# EAGLE schematic řídicí deska (EAGLE 9.5.1)
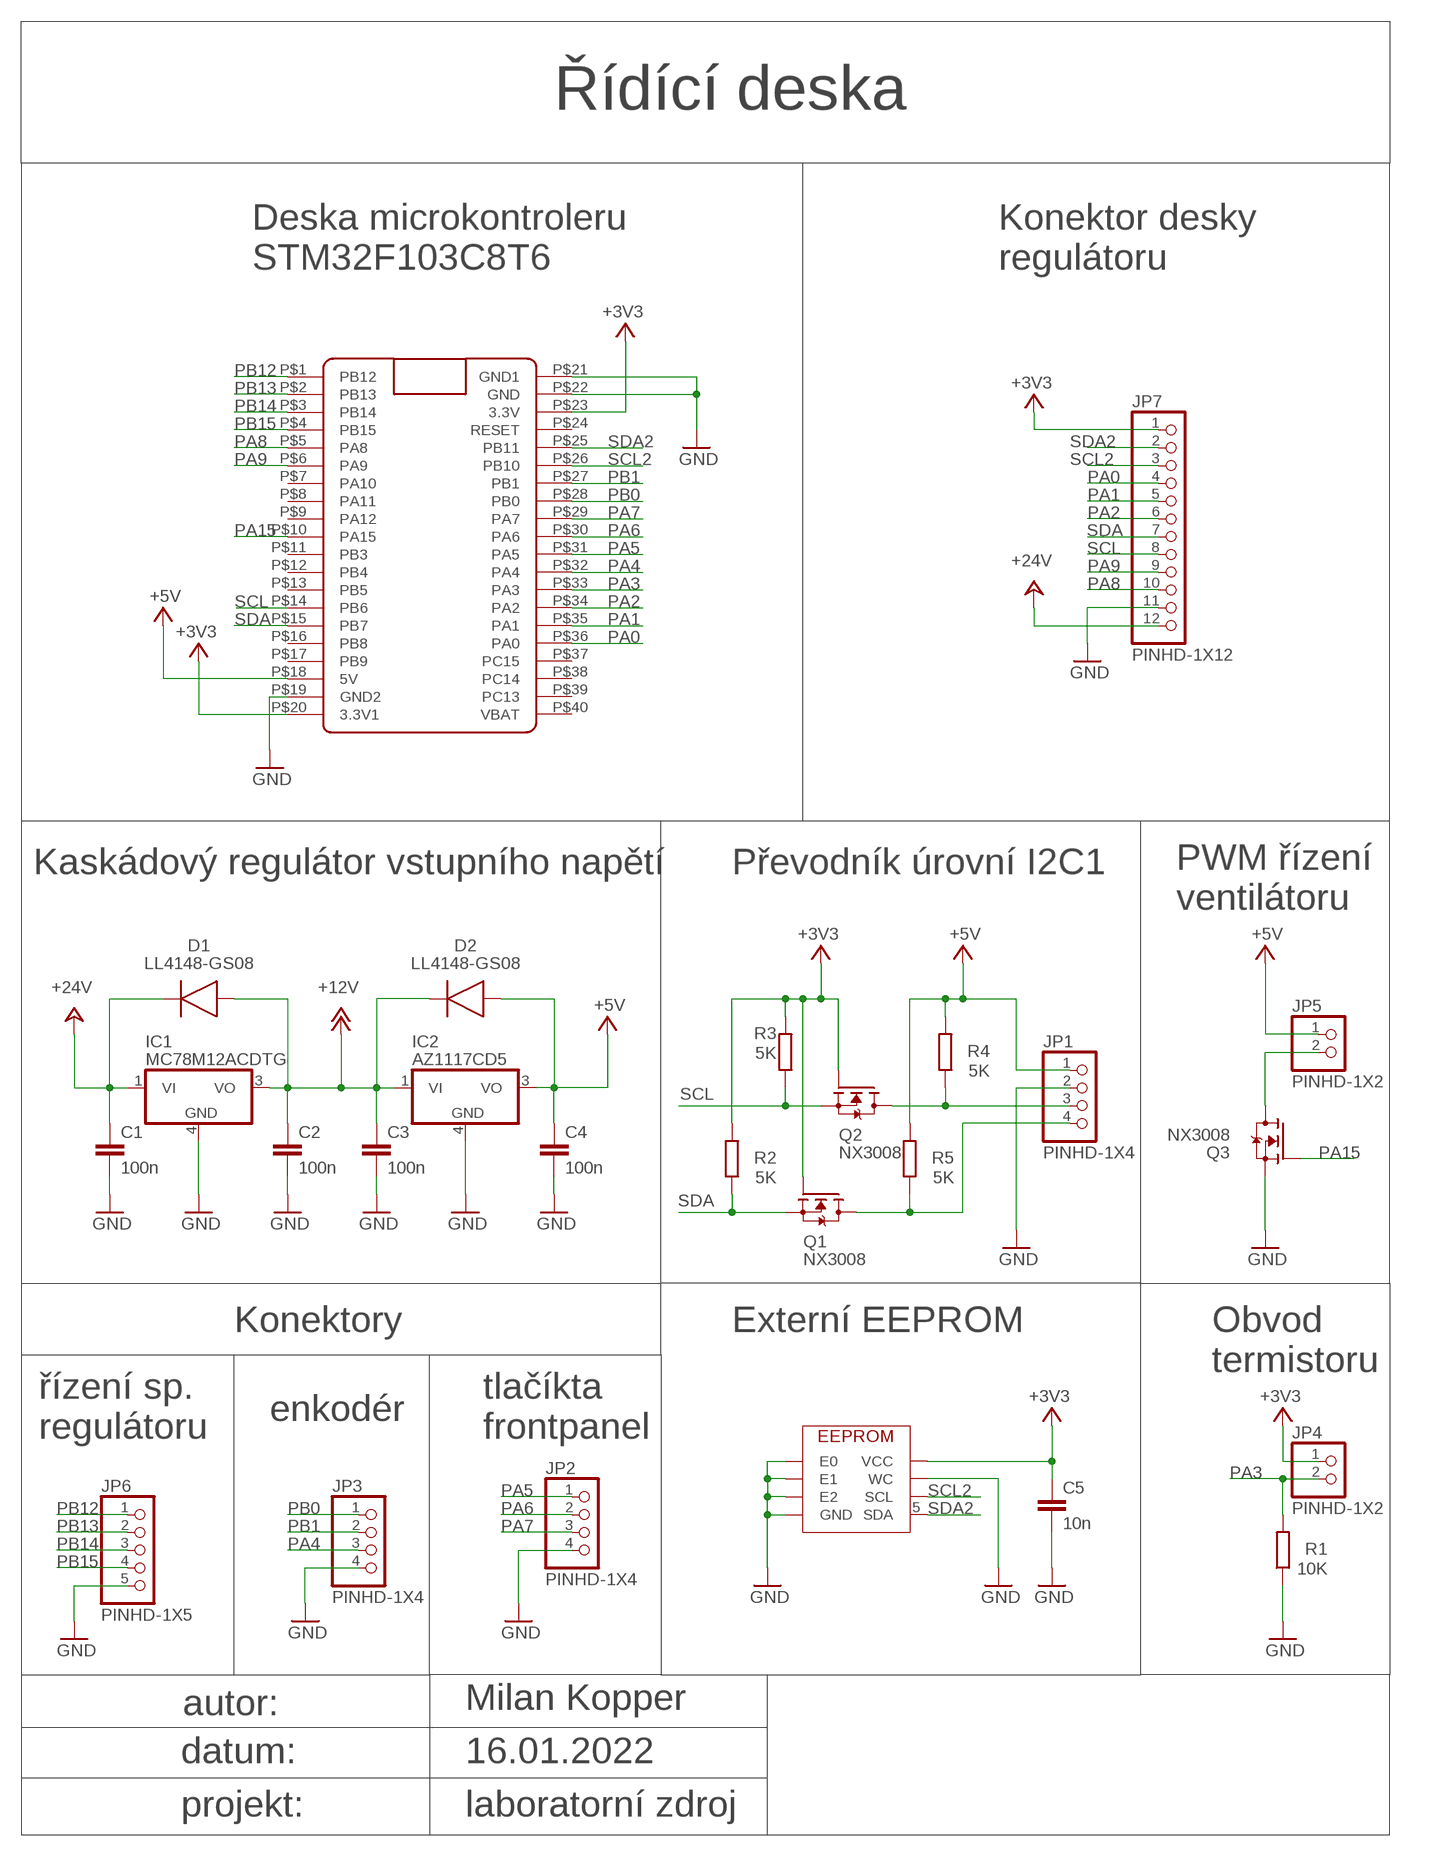
[diagram p0: schematic, sheet 1]

## Parts
C1  100n  C-EUC0805  [C0805]
C2  100n  C-EUC0805  [C0805]
C3  100n  C-EUC0805  [C0805]
C4  100n  C-EUC0805  [C0805]
C5  10n  C-EUC0805  [C0805]
D1  LL4148-GS08  DIODE_LL4148-GS08_SOD-80  [DIOMELF3516]
D2  LL4148-GS08  DIODE_LL4148-GS08_SOD-80  [DIOMELF3516]
IC1  MC78M12ACDTG  MC78M12BDTG  [DPACK_3]
IC2  AZ1117CD5  MC78M05CDTG  [DPACK_3]
JP1  PINHD-1X4  [1X04]
JP2  PINHD-1X4  [1X04]
JP3  PINHD-1X4  [1X04]
JP4  PINHD-1X2  [1X02]
JP5  PINHD-1X2  [1X02]
JP6  PINHD-1X5  [1X05]
JP7  PINHD-1X12  [1X12]
Q1  NX3008  [SOT95P240X110-3N]
Q2  NX3008  [SOT95P240X110-3N]
Q3  NX3008  [SOT95P240X110-3N]
R1  10K  R-EU_R0805  [R0805]
R2  5K  R-EU_R0805  [R0805]
R3  5K  R-EU_R0805  [R0805]
R4  5K  R-EU_R0805  [R0805]
R5  5K  R-EU_R0805  [R0805]
U$1  BLUE_PILL  [BLUE_PILL]
U$2  M24CXX  [SO8]

## Nets
+3V3: C5.1 JP4.1 JP7.1 Q1.1(G) Q2.1(G) R2.2 R3.2 U$1.P$20(3.3V1) U$1.P$23(3.3V) U$2.8(VCC)
+5V: C4.1 D2.2(A) IC2.3(VO) JP1.1 JP5.1 R4.2 R5.2 U$1.P$18(5V)
+12V: C2.1 C3.1 D1.2(A) D2.1(C) IC1.3(VO) IC2.1(VI)
+24V: C1.1 D1.1(C) IC1.1(VI) JP7.12
GND: C1.2 C2.2 C3.2 C4.2 C5.2 IC1.4(GND) IC2.4(GND) JP1.2 JP2.4 JP3.4 JP6.5 JP7.11 Q3.2(S) R1.1 U$1.P$19(GND2) U$1.P$21(GND1) U$1.P$22(GND) U$2.1(E0) U$2.2(E1) U$2.3(E2) U$2.4(GND) U$2.7(WC)
N$5: JP5.2 Q3.3(D)
N$6: JP1.3 Q2.3(D) R4.1
N$7: JP1.4 Q1.3(D) R5.1
PA0: JP7.4 U$1.P$36(PA0)
PA1: JP7.5 U$1.P$35(PA1)
PA2: JP7.6 U$1.P$34(PA2)
PA3: JP4.2 R1.2 U$1.P$33(PA3)
PA4: JP3.3 U$1.P$32(PA4)
PA5: JP2.1 U$1.P$31(PA5)
PA6: JP2.2 U$1.P$30(PA6)
PA7: JP2.3 U$1.P$29(PA7)
PA8: JP7.10 U$1.P$5(PA8)
PA9: JP7.9 U$1.P$6(PA9)
PA15: Q3.1(G) U$1.P$10(PA15)
PB0: JP3.1 U$1.P$28(PB0)
PB1: JP3.2 U$1.P$27(PB1)
PB12: JP6.1 U$1.P$1(PB12)
PB13: JP6.2 U$1.P$2(PB13)
PB14: JP6.3 U$1.P$3(PB14)
PB15: JP6.4 U$1.P$4(PB15)
SCL: JP7.8 Q2.2(S) R3.1 U$1.P$14(PB6)
SCL2: JP7.3 U$1.P$26(PB10) U$2.6(SCL)
SDA: JP7.7 Q1.2(S) R2.1 U$1.P$15(PB7)
SDA2: JP7.2 U$1.P$25(PB11) U$2.5(SDA)
Unconnected: U$1.P$7(PA10) U$1.P$8(PA11) U$1.P$9(PA12) U$1.P$11(PB3) U$1.P$12(PB4) U$1.P$13(PB5) U$1.P$16(PB8) U$1.P$17(PB9) U$1.P$24(RESET) U$1.P$37(PC15) U$1.P$38(PC14) U$1.P$39(PC13) U$1.P$40(VBAT)

## Notes on the sheet
- Řídící deska
- Deska microkontroleru
  STM32F103C8T6
- Konektor desky
  regulátoru
- Kaskádový regulátor vstupního napětí | Převodník úrovní I2C1
- PWM řízení
  ventilátoru
- Konektory | Externí EEPROM
- Obvod
  termistoru
- enkodér
- řízení sp.
  regulátoru
- tlačíkta
  frontpanel
- autor: | Milan Kopper
- datum: | 16.01.2022
- projekt: | laboratorní zdroj

## Library data of the parts
C1-C5 = rcl:C-EU: CAPACITOR, European symbol; SPICEPREFIX: C
D1 D2 = Diode:DIODE_: Diode Rectifier - Popular parts; CATEGORY: Diode; DESCRIPTION: DIODE GEN PURP 75V 300MA SOD80; MANUFACTURER: Vishay Semiconductor Diodes Division; SUB-CATEGORY: Rectifier
IC1 IC2 = linear:MC78M: 500 mA Positive Voltage Regulators Source: Data sheet <http://www.onsemi.com/pub_link/Collateral/MC78M00-D.PDF>
JP1-JP3 = Connector:PINHD-1X4: PIN HEADER; CATEGORY: CONNECTOR; SUB-CATEGORY: PIN-HEADER
JP4 JP5 = Connector:PINHD-1X2: PIN HEADER; CATEGORY: CONNECTOR; SUB-CATEGORY: PIN-HEADER
JP6 = Connector:PINHD-1X5: PIN HEADER; CATEGORY: CONNECTOR; SUB-CATEGORY: PIN-HEADER
JP7 = Connector:PINHD-1X12: PIN HEADER; CATEGORY: CONNECTOR; SUB-CATEGORY: PIN-HEADER
Q1-Q3 = NEXPERIA:NX3008
R1-R5 = rcl:R-EU_: RESISTOR, European symbol; SPICEPREFIX: R
U$1 = BluePill:BLUE_PILL
U$2 = eeprom:M24CXX